# EAGLE schematic MonthCalendar_Controller_v0.9 (EAGLE 9.4.1)
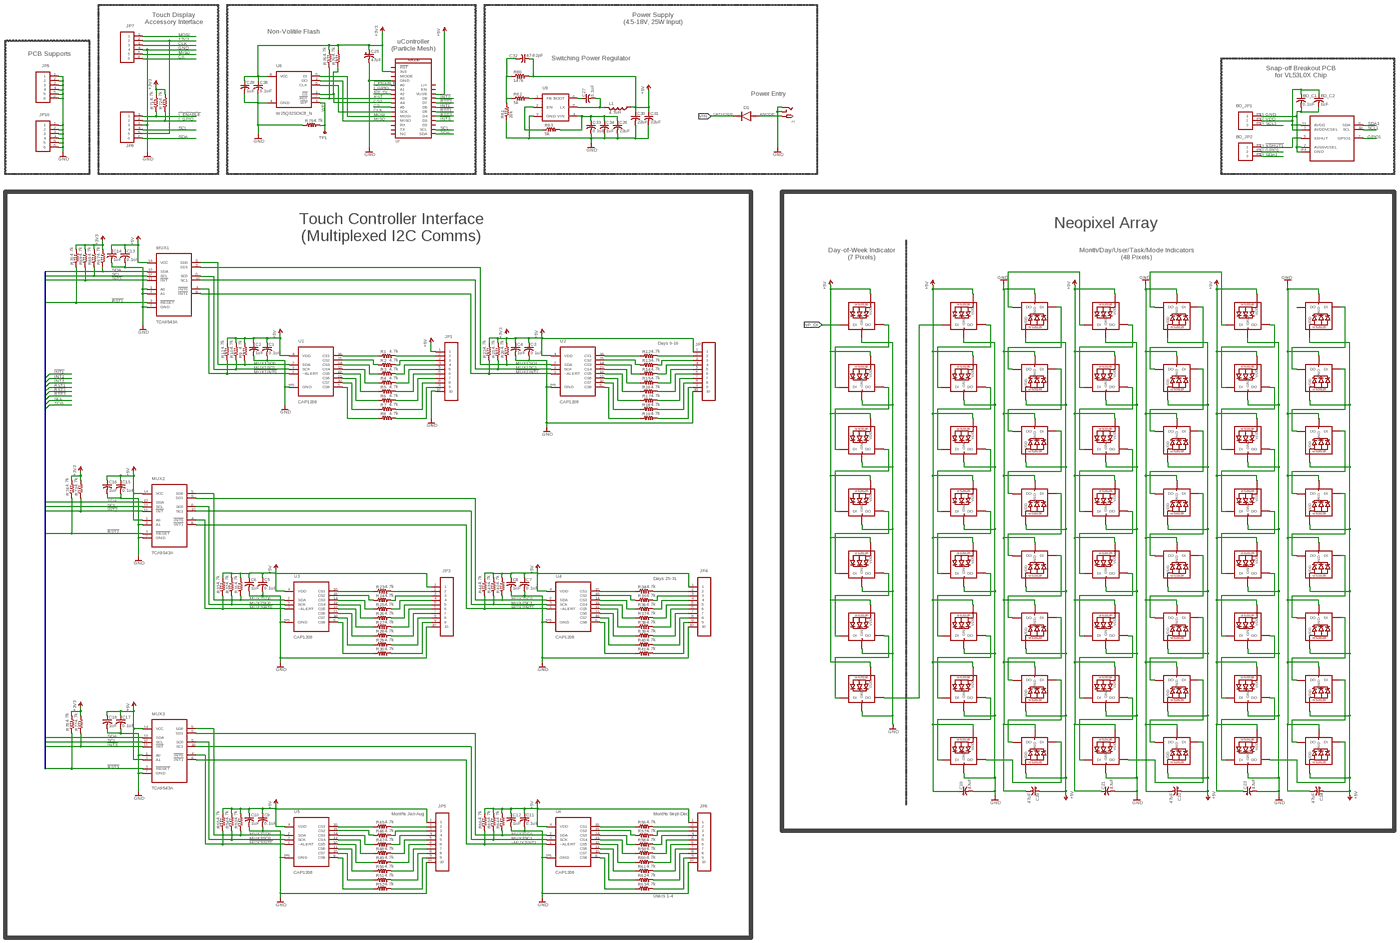
[diagram p0: schematic, sheet 1, overview]
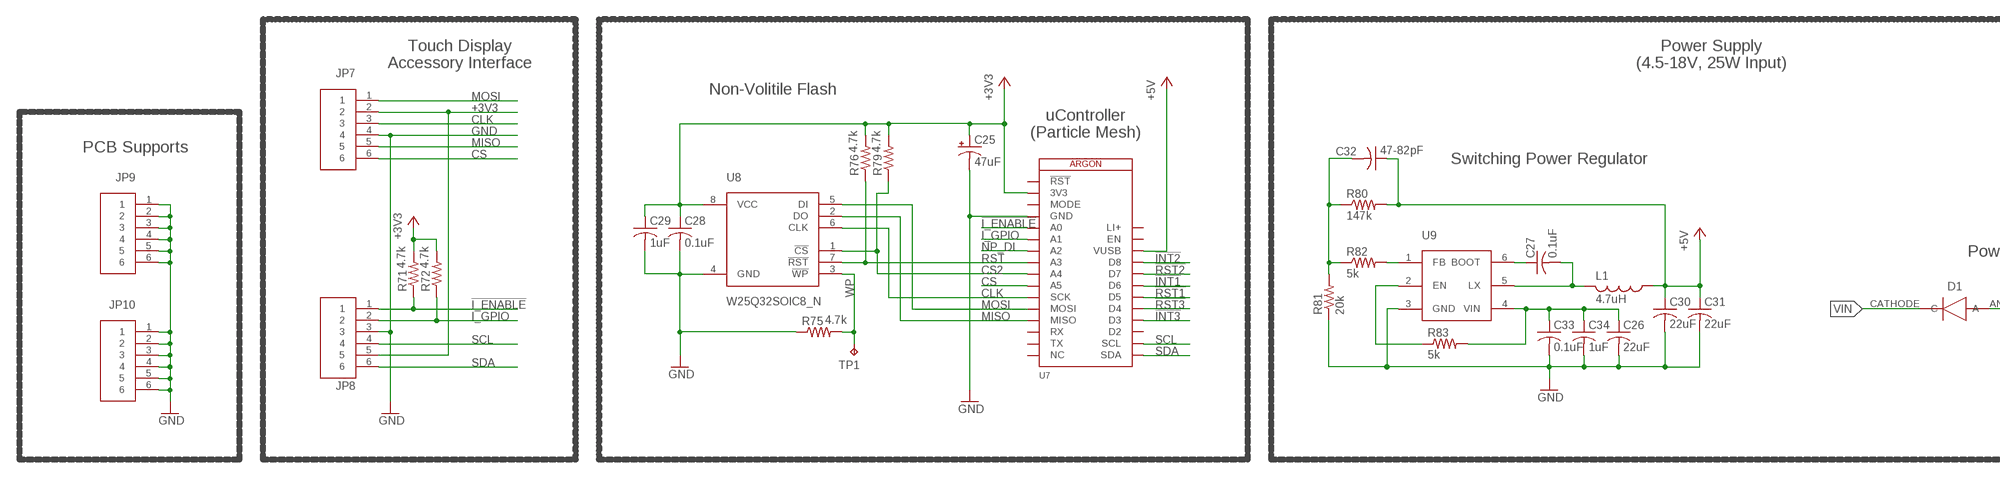
[diagram p1: schematic, sheet 1, part 1 of 4]
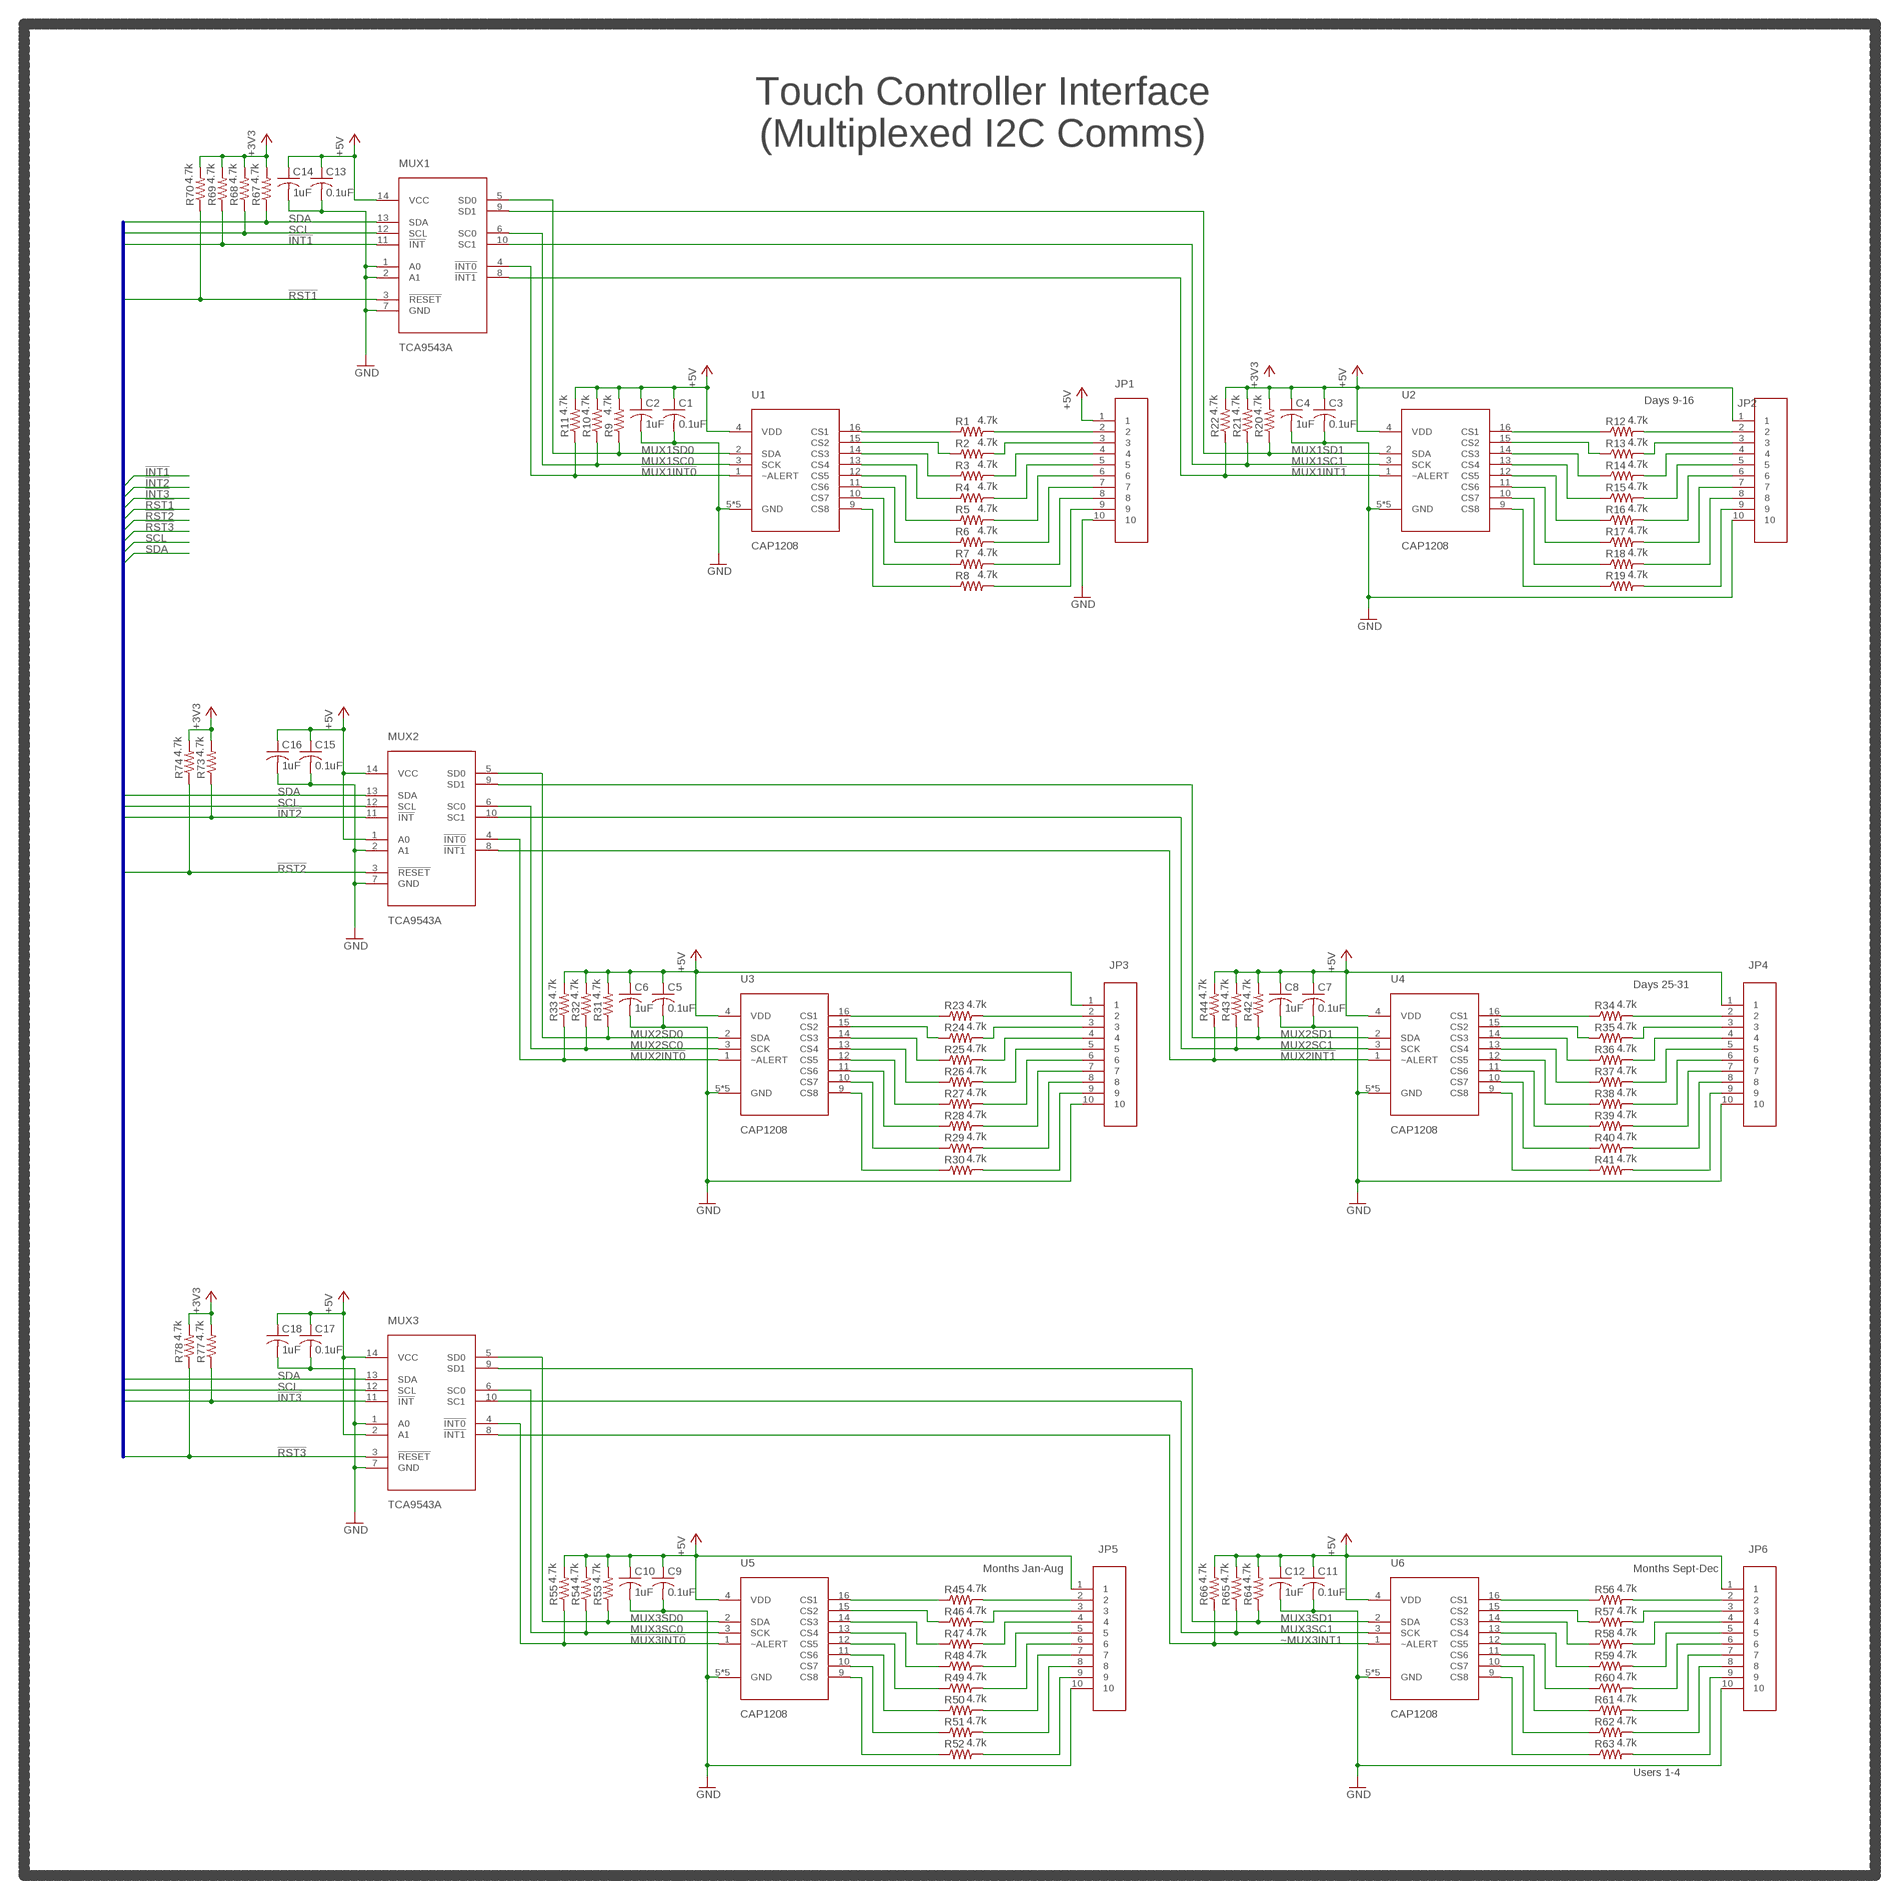
[diagram p2: schematic, sheet 1, part 2 of 4]
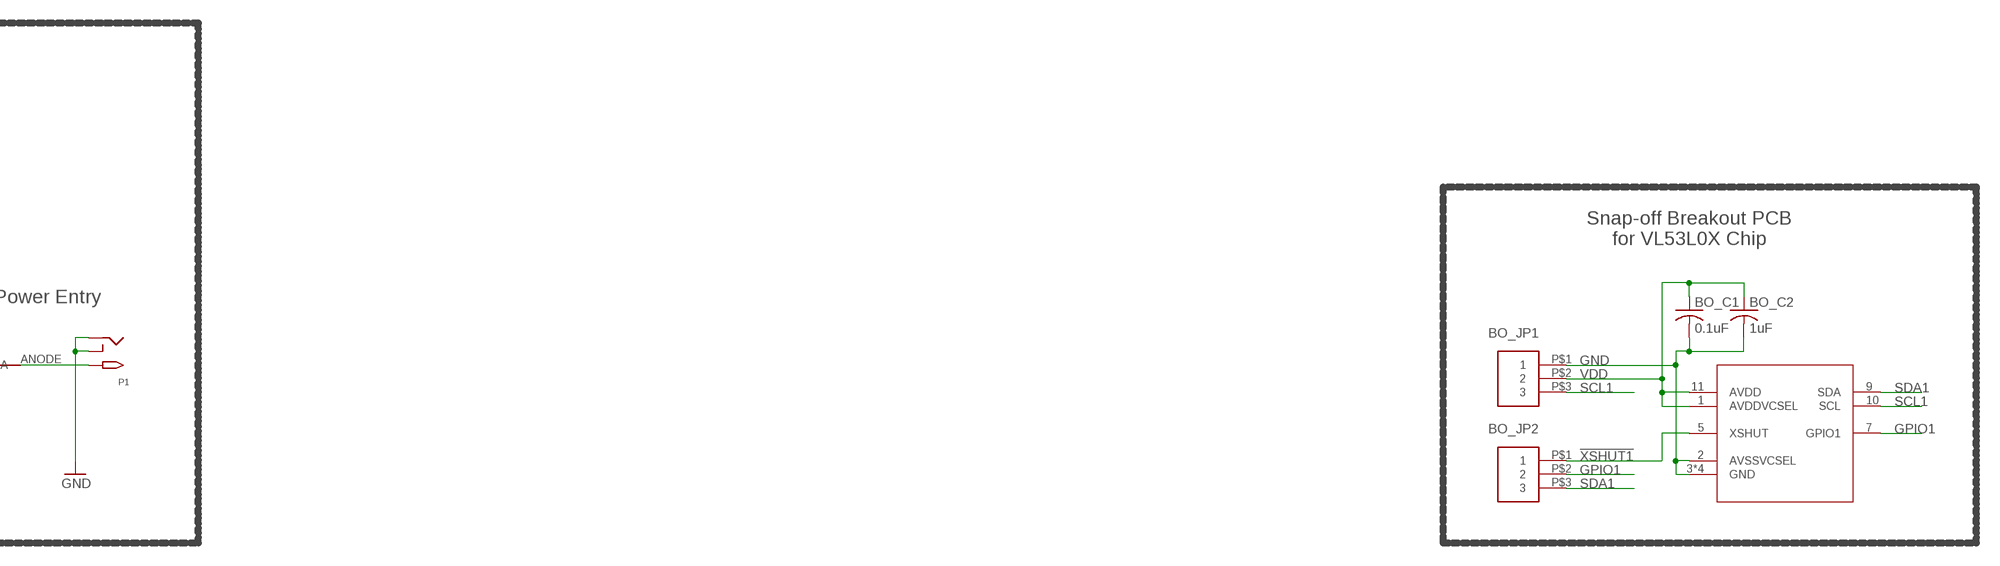
[diagram p3: schematic, sheet 1, part 3 of 4]
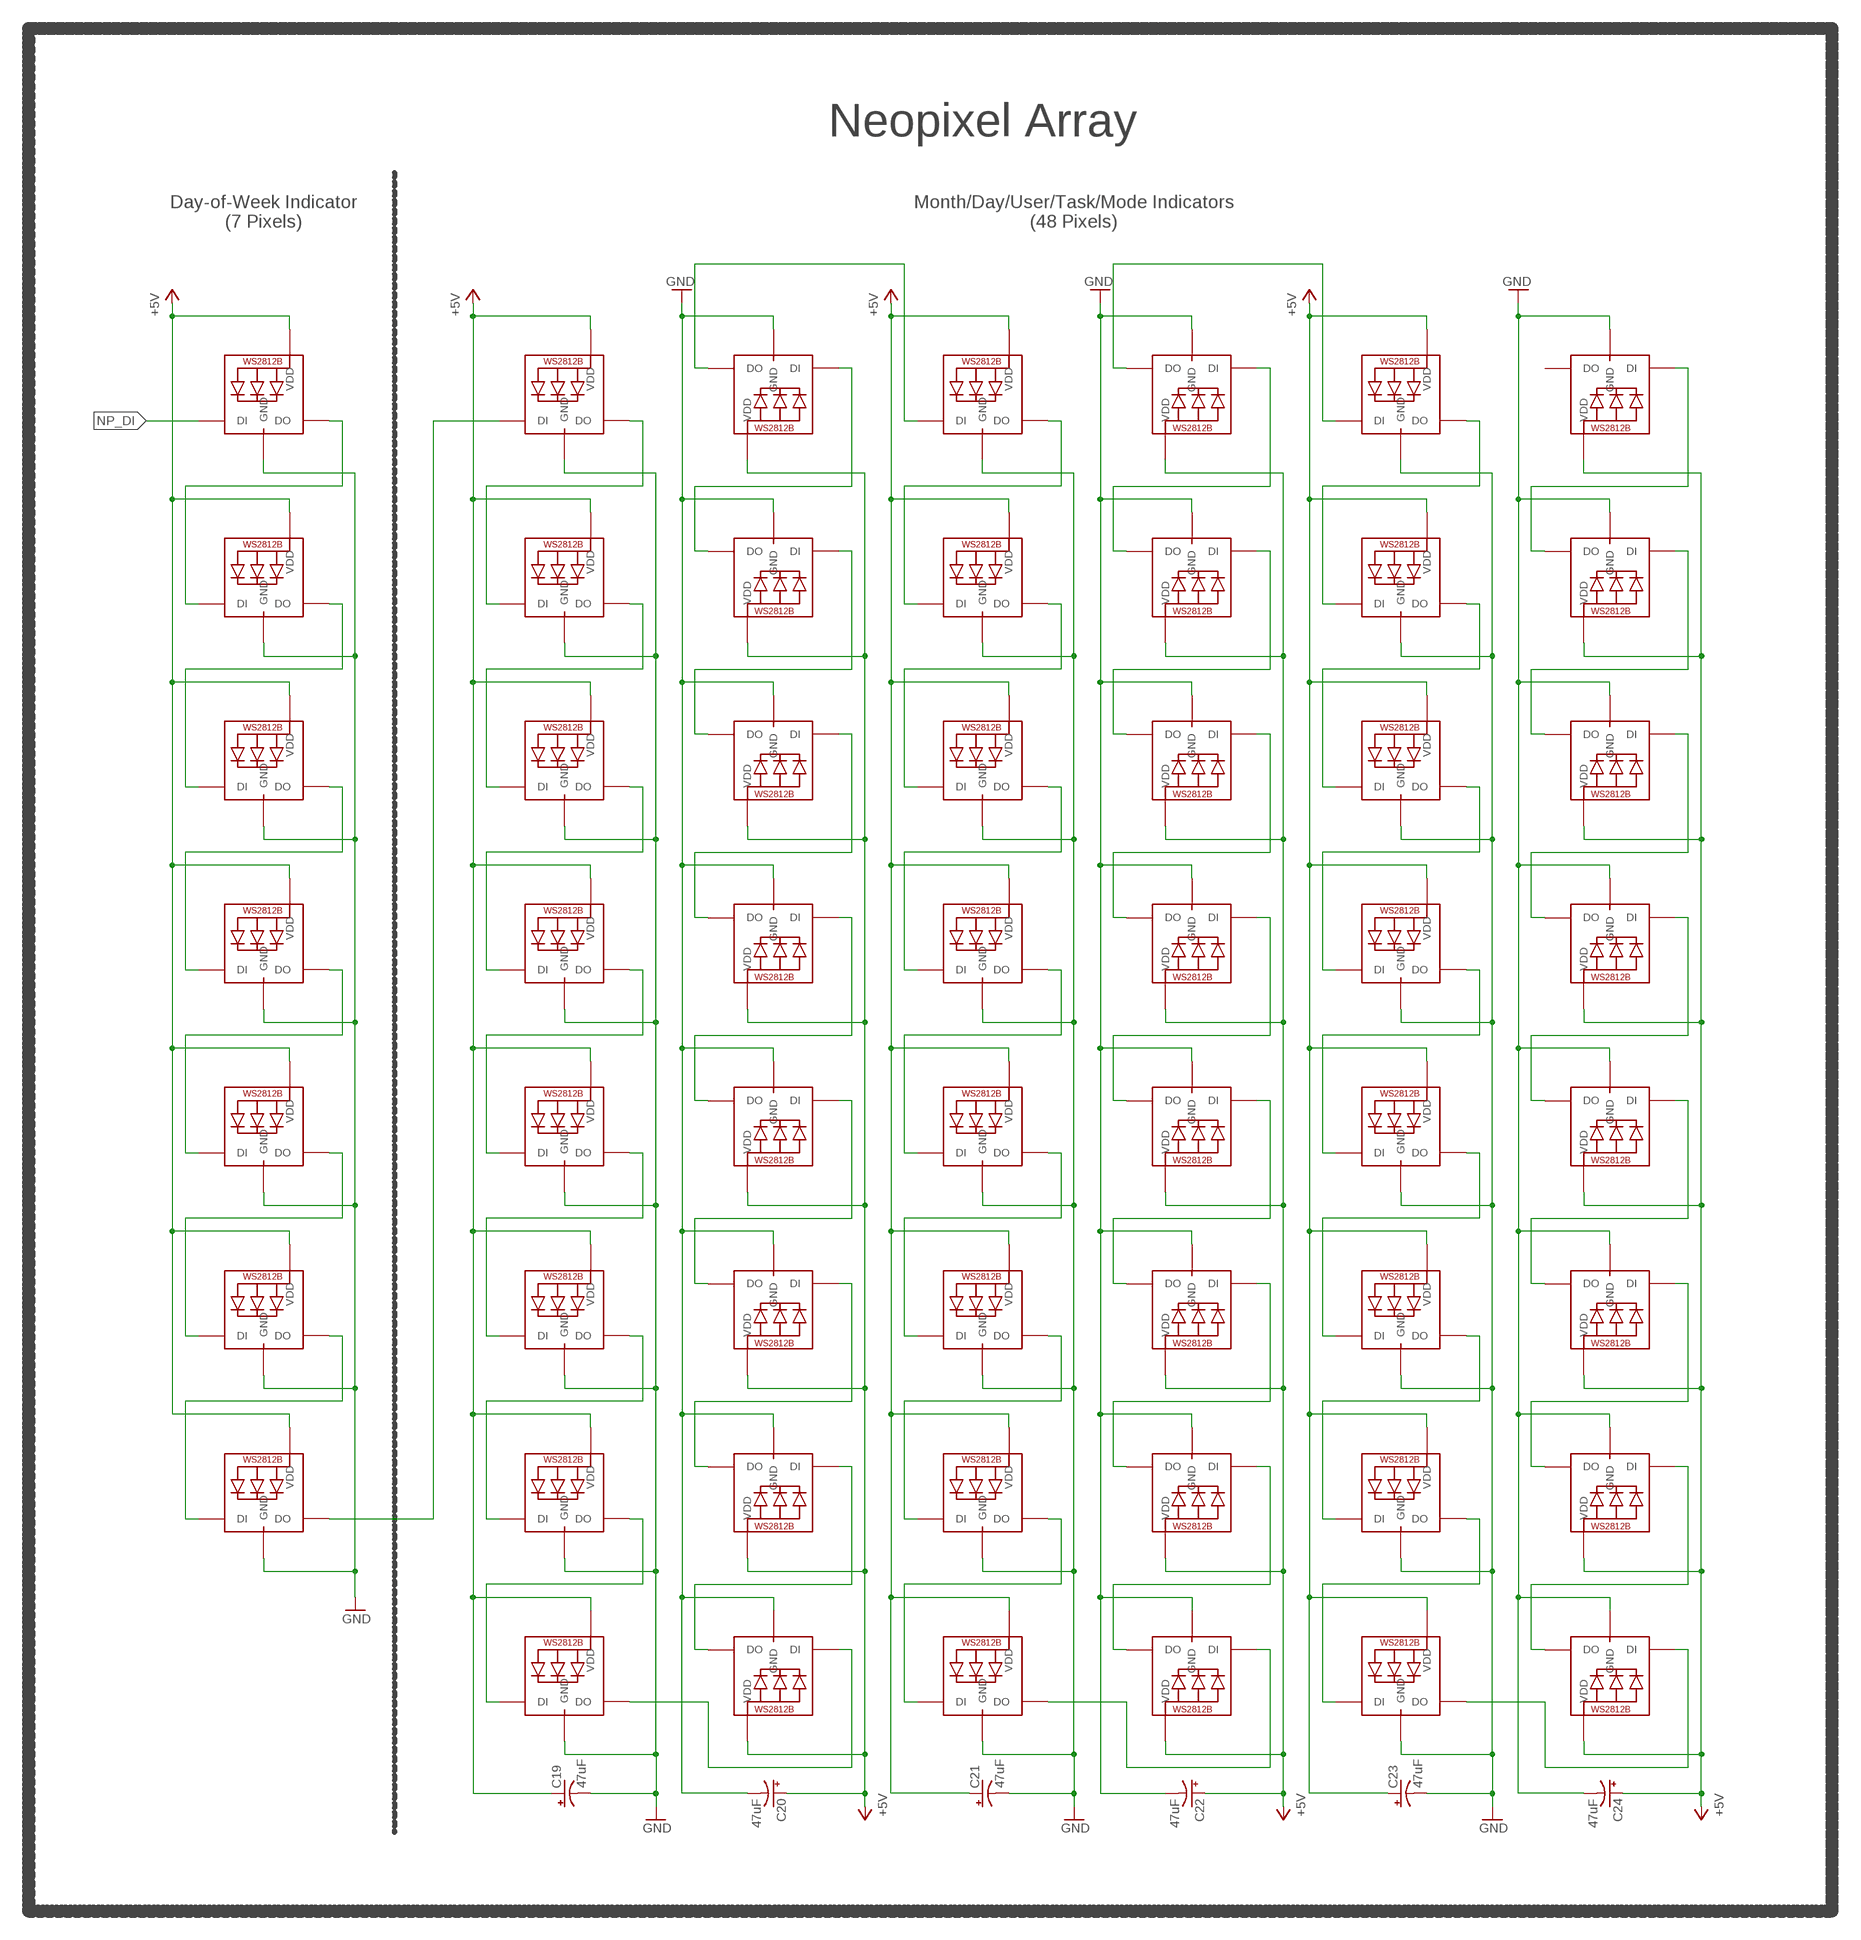
[diagram p4: schematic, sheet 1, part 4 of 4]

## Parts
BO_C1  0.1uF  C-USC0603  [C0603]
BO_C2  1uF  C-USC0603  [C0603]
BO_JP1  PINHEAD_1X350MIL  [PINHEAD_1X3_50MIL]
BO_JP2  PINHEAD_1X350MIL  [PINHEAD_1X3_50MIL]
BO_U1  VL53L0X  [VL53L0X]
C1  0.1uF  C-USC0603  [C0603]
C2  1uF  C-USC0603  [C0603]
C3  0.1uF  C-USC0603  [C0603]
C4  1uF  C-USC0603  [C0603]
C5  0.1uF  C-USC0603  [C0603]
C6  1uF  C-USC0603  [C0603]
C7  0.1uF  C-USC0603  [C0603]
C8  1uF  C-USC0603  [C0603]
C9  0.1uF  C-USC0603  [C0603]
C10  1uF  C-USC0603  [C0603]
C11  0.1uF  C-USC0603  [C0603]
C12  1uF  C-USC0603  [C0603]
C13  0.1uF  C-USC0603  [C0603]
C14  1uF  C-USC0603  [C0603]
C15  0.1uF  C-USC0603  [C0603]
C16  1uF  C-USC0603  [C0603]
C17  0.1uF  C-USC0603  [C0603]
C18  1uF  C-USC0603  [C0603]
C19  47uF  TANT-CAP1206  [EIA3216]
C20  47uF  TANT-CAP1206  [EIA3216]
C21  47uF  TANT-CAP1206  [EIA3216]
C22  47uF  TANT-CAP1206  [EIA3216]
C23  47uF  TANT-CAP1206  [EIA3216]
C24  47uF  TANT-CAP1206  [EIA3216]
C25  47uF  TANT-CAP1206  [EIA3216]
C26  22uF  C-USC1206  [C1206]
C27  0.1uF  C-USC0603  [C0603]
C28  0.1uF  C-USC0603  [C0603]
C29  1uF  C-USC0603  [C0603]
C30  22uF  C-USC1206  [C1206]
C31  22uF  C-USC1206  [C1206]
C32  47-82pF  C-USC0603  [C0603]
C33  0.1uF  C-USC0603  [C0603]
C34  1uF  C-USC0603  [C0603]
D1  DIODE  [SOD-128]
JP1  CON_10POS_1ROWHARWIN_M3531042  [CON_PINHEADER_10P_1R_TH_HARWIN_M50-3531042]
JP2  CON_10POS_1ROWHARWIN_M3531042  [CON_PINHEADER_10P_1R_TH_HARWIN_M50-3531042]
JP3  CON_10POS_1ROWHARWIN_M3531042  [CON_PINHEADER_10P_1R_TH_HARWIN_M50-3531042]
JP4  CON_10POS_1ROWHARWIN_M3531042  [CON_PINHEADER_10P_1R_TH_HARWIN_M50-3531042]
JP5  CON_10POS_1ROWHARWIN_M3531042  [CON_PINHEADER_10P_1R_TH_HARWIN_M50-3531042]
JP6  CON_10POS_1ROWHARWIN_M3531042  [CON_PINHEADER_10P_1R_TH_HARWIN_M50-3531042]
JP7  CON_6POS_1ROW6P1R_M50_35306  [CON_PINHEADER_6P_1R_TH_HARWIN_M50-3530642]
JP8  CON_6POS_1ROW6P1R_M50_35306  [CON_PINHEADER_6P_1R_TH_HARWIN_M50-3530642]
JP9  CON_6POS_1ROW6P1R_M50_35306  [CON_PINHEADER_6P_1R_TH_HARWIN_M50-3530642]
JP10  CON_6POS_1ROW6P1R_M50_35306  [CON_PINHEADER_6P_1R_TH_HARWIN_M50-3530642]
L1  4.7uH  L-US0207/5V  [0207/5V]
LED1  WS2812B5050  [WS2812B]
LED2  WS2812B5050  [WS2812B]
LED3  WS2812B5050  [WS2812B]
LED4  WS2812B5050  [WS2812B]
LED5  WS2812B5050  [WS2812B]
LED6  WS2812B5050  [WS2812B]
LED7  WS2812B5050  [WS2812B]
LED8  WS2812B5050  [WS2812B]
LED9  WS2812B5050  [WS2812B]
LED10  WS2812B5050  [WS2812B]
LED11  WS2812B5050  [WS2812B]
LED12  WS2812B5050  [WS2812B]
LED13  WS2812B5050  [WS2812B]
LED14  WS2812B5050  [WS2812B]
LED15  WS2812B5050  [WS2812B]
LED16  WS2812B5050  [WS2812B]
LED17  WS2812B5050  [WS2812B]
LED18  WS2812B5050  [WS2812B]
LED19  WS2812B5050  [WS2812B]
LED20  WS2812B5050  [WS2812B]
LED21  WS2812B5050  [WS2812B]
LED22  WS2812B5050  [WS2812B]
LED23  WS2812B5050  [WS2812B]
LED24  WS2812B5050  [WS2812B]
LED25  WS2812B5050  [WS2812B]
LED26  WS2812B5050  [WS2812B]
LED27  WS2812B5050  [WS2812B]
LED28  WS2812B5050  [WS2812B]
LED29  WS2812B5050  [WS2812B]
LED30  WS2812B5050  [WS2812B]
LED31  WS2812B5050  [WS2812B]
LED32  WS2812B5050  [WS2812B]
LED33  WS2812B5050  [WS2812B]
LED34  WS2812B5050  [WS2812B]
LED35  WS2812B5050  [WS2812B]
LED36  WS2812B5050  [WS2812B]
LED37  WS2812B5050  [WS2812B]
LED38  WS2812B5050  [WS2812B]
LED39  WS2812B5050  [WS2812B]
LED40  WS2812B5050  [WS2812B]
LED41  WS2812B5050  [WS2812B]
LED42  WS2812B5050  [WS2812B]
LED43  WS2812B5050  [WS2812B]
LED44  WS2812B5050  [WS2812B]
LED45  WS2812B5050  [WS2812B]
LED46  WS2812B5050  [WS2812B]
LED47  WS2812B5050  [WS2812B]
LED48  WS2812B5050  [WS2812B]
LED49  WS2812B5050  [WS2812B]
LED50  WS2812B5050  [WS2812B]
LED51  WS2812B5050  [WS2812B]
LED52  WS2812B5050  [WS2812B]
LED53  WS2812B5050  [WS2812B]
LED54  WS2812B5050  [WS2812B]
LED55  WS2812B5050  [WS2812B]
MUX1  TCA9543A  [TSSOP-14]
MUX2  TCA9543A  [TSSOP-14]
MUX3  TCA9543A  [TSSOP-14]
P1  2.1MMJACKTHM  [PJ-102A]
R1  4.7k  R-US_R0603  [R0603]
R2  4.7k  R-US_R0603  [R0603]
R3  4.7k  R-US_R0603  [R0603]
R4  4.7k  R-US_R0603  [R0603]
R5  4.7k  R-US_R0603  [R0603]
R6  4.7k  R-US_R0603  [R0603]
R7  4.7k  R-US_R0603  [R0603]
R8  4.7k  R-US_R0603  [R0603]
R9  4.7k  R-US_R0603  [R0603]
R10  4.7k  R-US_R0603  [R0603]
R11  4.7k  R-US_R0603  [R0603]
R12  4.7k  R-US_R0603  [R0603]
R13  4.7k  R-US_R0603  [R0603]
R14  4.7k  R-US_R0603  [R0603]
R15  4.7k  R-US_R0603  [R0603]
R16  4.7k  R-US_R0603  [R0603]
R17  4.7k  R-US_R0603  [R0603]
R18  4.7k  R-US_R0603  [R0603]
R19  4.7k  R-US_R0603  [R0603]
R20  4.7k  R-US_R0603  [R0603]
R21  4.7k  R-US_R0603  [R0603]
R22  4.7k  R-US_R0603  [R0603]
R23  4.7k  R-US_R0603  [R0603]
R24  4.7k  R-US_R0603  [R0603]
R25  4.7k  R-US_R0603  [R0603]
R26  4.7k  R-US_R0603  [R0603]
R27  4.7k  R-US_R0603  [R0603]
R28  4.7k  R-US_R0603  [R0603]
R29  4.7k  R-US_R0603  [R0603]
R30  4.7k  R-US_R0603  [R0603]
R31  4.7k  R-US_R0603  [R0603]
R32  4.7k  R-US_R0603  [R0603]
R33  4.7k  R-US_R0603  [R0603]
R34  4.7k  R-US_R0603  [R0603]
R35  4.7k  R-US_R0603  [R0603]
R36  4.7k  R-US_R0603  [R0603]
R37  4.7k  R-US_R0603  [R0603]
R38  4.7k  R-US_R0603  [R0603]
R39  4.7k  R-US_R0603  [R0603]
R40  4.7k  R-US_R0603  [R0603]
R41  4.7k  R-US_R0603  [R0603]
R42  4.7k  R-US_R0603  [R0603]
R43  4.7k  R-US_R0603  [R0603]
R44  4.7k  R-US_R0603  [R0603]
R45  4.7k  R-US_R0603  [R0603]
R46  4.7k  R-US_R0603  [R0603]
R47  4.7k  R-US_R0603  [R0603]
R48  4.7k  R-US_R0603  [R0603]
R49  4.7k  R-US_R0603  [R0603]
R50  4.7k  R-US_R0603  [R0603]
R51  4.7k  R-US_R0603  [R0603]
R52  4.7k  R-US_R0603  [R0603]
R53  4.7k  R-US_R0603  [R0603]
R54  4.7k  R-US_R0603  [R0603]
R55  4.7k  R-US_R0603  [R0603]
R56  4.7k  R-US_R0603  [R0603]
R57  4.7k  R-US_R0603  [R0603]
R58  4.7k  R-US_R0603  [R0603]
R59  4.7k  R-US_R0603  [R0603]
R60  4.7k  R-US_R0603  [R0603]
R61  4.7k  R-US_R0603  [R0603]
R62  4.7k  R-US_R0603  [R0603]
R63  4.7k  R-US_R0603  [R0603]
R64  4.7k  R-US_R0603  [R0603]
R65  4.7k  R-US_R0603  [R0603]
R66  4.7k  R-US_R0603  [R0603]
R67  4.7k  R-US_R0603  [R0603]
R68  4.7k  R-US_R0603  [R0603]
R69  4.7k  R-US_R0603  [R0603]
R70  4.7k  R-US_R0603  [R0603]
R71  4.7k  R-US_R0603  [R0603]
R72  4.7k  R-US_R0603  [R0603]
R73  4.7k  R-US_R0603  [R0603]
R74  4.7k  R-US_R0603  [R0603]
R75  4.7k  R-US_R0603  [R0603]
R76  4.7k  R-US_R0603  [R0603]
R77  4.7k  R-US_R0603  [R0603]
R78  4.7k  R-US_R0603  [R0603]
R79  4.7k  R-US_R0603  [R0603]
R80  147k  R-US_R0603  [R0603]
R81  20k  R-US_R0603  [R0603]
R82  5k  R-US_R0603  [R0603]
R83  5k  R-US_R0603  [R0603]
TP1  TPTP20SQ  [TP20SQ]
U1  CAP1208  [QFN-16-3X3]
U2  CAP1208  [QFN-16-3X3]
U3  CAP1208  [QFN-16-3X3]
U4  CAP1208  [QFN-16-3X3]
U5  CAP1208  [QFN-16-3X3]
U6  CAP1208  [QFN-16-3X3]
U7  ARGON  [ARGON]
U8  W25Q32SOIC8_N  [SOIC-8_NARROW]
U9  RT6255AHGJ6FCT-ND  RT6255A/B_J6F  [SOT-23-6]

## Nets
!I_ENABLE: JP8.1 R71.1 U7.5(A0)
!INT1: MUX1.11(!INT) R69.1 U7.23(D6)
!INT2: MUX2.11(!INT) R73.1 U7.25(D8)
!INT3: MUX3.11(!INT) R77.1 U7.20(D3)
!MUX1INT0: MUX1.4(!INT0) R11.1 U1.1(~ALERT)
!MUX1INT1: MUX1.8(!INT1) R22.1 U2.1(~ALERT)
!MUX2INT0: MUX2.4(!INT0) R33.1 U3.1(~ALERT)
!MUX2INT1: MUX2.8(!INT1) R44.1 U4.1(~ALERT)
!MUX3INT0: MUX3.4(!INT0) R55.1 U5.1(~ALERT)
!RST1: MUX1.3(!RESET) R70.1 U7.22(D5)
!RST2: MUX2.3(!RESET) R74.1 U7.24(D7)
!RST3: MUX3.3(!RESET) R78.1 U7.21(D4)
!XSHUT1: BO_JP2.P$1 BO_U1.5(XSHUT)
+3V3: C25.A(+) C28.1 C29.1 JP7.2 JP8.5 R67.2 R68.2 R69.2 R70.2 R71.2 R72.2 R73.2 R74.2 R76.2 R77.2 R78.2 R79.2 U7.2(3V3) U8.8(VCC)
+5V: C1.1 C2.1 C3.1 C4.1 C5.1 C6.1 C7.1 C8.1 C9.1 C10.1 C11.1 C12.1 C13.1 C14.1 C15.1 C16.1 C17.1 C18.1 C19.A(+) C20.A(+) C21.A(+) C22.A(+) C23.A(+) C24.A(+) C30.1 C31.1 C32.1 JP1.1 JP2.1 JP3.1 JP4.1 JP5.1 JP6.1 L1.1 LED1.1-VDD(VDD) LED2.1-VDD(VDD) LED3.1-VDD(VDD) LED4.1-VDD(VDD) LED5.1-VDD(VDD) LED6.1-VDD(VDD) LED7.1-VDD(VDD) LED8.1-VDD(VDD) LED9.1-VDD(VDD) LED10.1-VDD(VDD) LED11.1-VDD(VDD) LED12.1-VDD(VDD) LED13.1-VDD(VDD) LED14.1-VDD(VDD) LED15.1-VDD(VDD) LED16.1-VDD(VDD) LED17.1-VDD(VDD) LED18.1-VDD(VDD) LED19.1-VDD(VDD) LED20.1-VDD(VDD) LED21.1-VDD(VDD) LED22.1-VDD(VDD) LED23.1-VDD(VDD) LED24.1-VDD(VDD) LED25.1-VDD(VDD) LED26.1-VDD(VDD) LED27.1-VDD(VDD) LED28.1-VDD(VDD) LED29.1-VDD(VDD) LED30.1-VDD(VDD) LED31.1-VDD(VDD) LED32.1-VDD(VDD) LED33.1-VDD(VDD) LED34.1-VDD(VDD) LED35.1-VDD(VDD) LED36.1-VDD(VDD) LED37.1-VDD(VDD) LED38.1-VDD(VDD) LED39.1-VDD(VDD) LED40.1-VDD(VDD) LED41.1-VDD(VDD) LED42.1-VDD(VDD) LED43.1-VDD(VDD) LED44.1-VDD(VDD) LED45.1-VDD(VDD) LED46.1-VDD(VDD) LED47.1-VDD(VDD) LED48.1-VDD(VDD) LED49.1-VDD(VDD) LED50.1-VDD(VDD) LED51.1-VDD(VDD) LED52.1-VDD(VDD) LED53.1-VDD(VDD) LED54.1-VDD(VDD) LED55.1-VDD(VDD) MUX1.14(VCC) MUX2.1(A0) MUX2.14(VCC) MUX3.2(A1) MUX3.14(VCC) R9.2 R10.2 R11.2 R20.2 R21.2 R22.2 R31.2 R32.2 R33.2 R42.2 R43.2 R44.2 R53.2 R54.2 R55.2 R64.2 R65.2 R66.2 R80.2 U1.4(VDD) U2.4(VDD) U3.4(VDD) U4.4(VDD) U5.4(VDD) U6.4(VDD) U7.26(VUSB)
BOOT: C27.1 U9.6(BOOT)
CLK: JP7.3 U7.11(SCK) U8.6(CLK)
CS: JP7.6 U7.10(A5)
CS2: R79.1 U7.9(A4) U8.1(!CS)
EN: R83.1 U9.2(EN)
FB: R82.2 U9.1(FB)
GND: BO_C1.2 BO_C2.2 BO_JP1.P$1 BO_U1.2(AVSSVCSEL) BO_U1.3(GND) BO_U1.4(GND) BO_U1.6(GND) BO_U1.12(GND) C1.2 C2.2 C3.2 C4.2 C5.2 C6.2 C7.2 C8.2 C9.2 C10.2 C11.2 C12.2 C13.2 C14.2 C15.2 C16.2 C17.2 C18.2 C19.C(-) C20.C(-) C21.C(-) C22.C(-) C23.C(-) C24.C(-) C25.C(-) C26.2 C28.2 C29.2 C30.2 C31.2 C33.2 C34.2 JP1.10 JP2.10 JP3.10 JP4.10 JP5.10 JP6.10 JP7.4 JP8.3 JP9.1 JP9.2 JP9.3 JP9.4 JP9.5 JP9.6 JP10.1 JP10.2 JP10.3 JP10.4 JP10.5 JP10.6 LED1.3-GND(GND) LED2.3-GND(GND) LED3.3-GND(GND) LED4.3-GND(GND) LED5.3-GND(GND) LED6.3-GND(GND) LED7.3-GND(GND) LED8.3-GND(GND) LED9.3-GND(GND) LED10.3-GND(GND) LED11.3-GND(GND) LED12.3-GND(GND) LED13.3-GND(GND) LED14.3-GND(GND) LED15.3-GND(GND) LED16.3-GND(GND) LED17.3-GND(GND) LED18.3-GND(GND) LED19.3-GND(GND) LED20.3-GND(GND) LED21.3-GND(GND) LED22.3-GND(GND) LED23.3-GND(GND) LED24.3-GND(GND) LED25.3-GND(GND) LED26.3-GND(GND) LED27.3-GND(GND) LED28.3-GND(GND) LED29.3-GND(GND) LED30.3-GND(GND) LED31.3-GND(GND) LED32.3-GND(GND) LED33.3-GND(GND) LED34.3-GND(GND) LED35.3-GND(GND) LED36.3-GND(GND) LED37.3-GND(GND) LED38.3-GND(GND) LED39.3-GND(GND) LED40.3-GND(GND) LED41.3-GND(GND) LED42.3-GND(GND) LED43.3-GND(GND) LED44.3-GND(GND) LED45.3-GND(GND) LED46.3-GND(GND) LED47.3-GND(GND) LED48.3-GND(GND) LED49.3-GND(GND) LED50.3-GND(GND) LED51.3-GND(GND) LED52.3-GND(GND) LED53.3-GND(GND) LED54.3-GND(GND) LED55.3-GND(GND) MUX1.1(A0) MUX1.2(A1) MUX1.7(GND) MUX2.2(A1) MUX2.7(GND) MUX3.1(A0) MUX3.7(GND) P1.RING P1.RING_SW R75.1 R81.1 U1.5(GND) U1.6(GND) U1.7(GND) U1.8(GND) U1.PAD(GND) U2.5(GND) U2.6(GND) U2.7(GND) U2.8(GND) U2.PAD(GND) U3.5(GND) U3.6(GND) U3.7(GND) U3.8(GND) U3.PAD(GND) U4.5(GND) U4.6(GND) U4.7(GND) U4.8(GND) U4.PAD(GND) U5.5(GND) U5.6(GND) U5.7(GND) U5.8(GND) U5.PAD(GND) U6.5(GND) U6.6(GND) U6.7(GND) U6.8(GND) U6.PAD(GND) U7.4(GND) U8.4(GND) U9.3(GND)
GPIO1: BO_JP2.P$2 BO_U1.7(GPIO1)
I_GPIO: JP8.2 R72.1 U7.6(A1)
LX: C27.2 L1.2 U9.5(LX)
MISO: JP7.5 U7.13(MISO) U8.2(DO)
MOSI: JP7.1 U7.12(MOSI) U8.5(DI)
MUX1SC0: MUX1.6(SC0) R10.1 U1.3(SCK)
MUX1SC1: MUX1.10(SC1) R21.1 U2.3(SCK)
MUX1SD0: MUX1.5(SD0) R9.1 U1.2(SDA)
MUX1SD1: MUX1.9(SD1) R20.1 U2.2(SDA)
MUX2SC0: MUX2.6(SC0) R32.1 U3.3(SCK)
MUX2SC1: MUX2.10(SC1) R43.1 U4.3(SCK)
MUX2SD0: MUX2.5(SD0) R31.1 U3.2(SDA)
MUX2SD1: MUX2.9(SD1) R42.1 U4.2(SDA)
MUX3SC0: MUX3.6(SC0) R54.1 U5.3(SCK)
MUX3SC1: MUX3.10(SC1) R65.1 U6.3(SCK)
MUX3SD0: MUX3.5(SD0) R53.1 U5.2(SDA)
MUX3SD1: MUX3.9(SD1) R64.1 U6.2(SDA)
N$1: R1.1 U1.16(CS1)
N$2: JP1.2 R1.2
N$3: JP1.3 R2.2
N$4: R2.1 U1.15(CS2)
N$5: R3.1 U1.14(CS3)
N$6: R4.1 U1.13(CS4)
N$7: R5.1 U1.12(CS5)
N$8: R6.1 U1.11(CS6)
N$9: R7.1 U1.10(CS7)
N$10: R8.1 U1.9(CS8)
N$11: JP1.4 R3.2
N$12: R12.1 U2.16(CS1)
N$13: R13.1 U2.15(CS2)
N$14: R14.1 U2.14(CS3)
N$15: R15.1 U2.13(CS4)
N$16: R16.1 U2.12(CS5)
N$17: R17.1 U2.11(CS6)
N$18: R18.1 U2.10(CS7)
N$19: R19.1 U2.9(CS8)
N$20: JP2.2 R12.2
N$21: JP1.5 R4.2
N$22: JP1.6 R5.2
N$23: JP1.7 R6.2
N$24: JP1.8 R7.2
N$25: JP1.9 R8.2
N$26: LED1.2-DOUT(DO) LED2.4-DIN(DI)
N$27: LED2.2-DOUT(DO) LED3.4-DIN(DI)
N$28: LED3.2-DOUT(DO) LED4.4-DIN(DI)
N$29: JP2.3 R13.2
N$30: JP2.4 R14.2
N$31: JP2.5 R15.2
N$32: JP2.6 R16.2
N$33: JP2.7 R17.2
N$34: JP2.8 R18.2
N$35: JP2.9 R19.2
N$36: LED4.2-DOUT(DO) LED5.4-DIN(DI)
N$37: LED5.2-DOUT(DO) LED6.4-DIN(DI)
N$38: LED6.2-DOUT(DO) LED7.4-DIN(DI)
N$39: R23.1 U3.16(CS1)
N$40: R24.1 U3.15(CS2)
N$41: R25.1 U3.14(CS3)
N$42: R26.1 U3.13(CS4)
N$43: R27.1 U3.12(CS5)
N$44: R28.1 U3.11(CS6)
N$45: R29.1 U3.10(CS7)
N$46: R30.1 U3.9(CS8)
N$47: JP3.2 R23.2
N$48: JP3.3 R24.2
N$49: JP3.4 R25.2
N$50: JP3.5 R26.2
N$51: JP3.6 R27.2
N$52: JP3.7 R28.2
N$53: JP3.8 R29.2
N$54: JP3.9 R30.2
N$55: LED7.2-DOUT(DO) LED8.4-DIN(DI)
N$56: LED9.2-DOUT(DO) LED10.4-DIN(DI)
N$57: LED10.2-DOUT(DO) LED11.4-DIN(DI)
N$58: R34.1 U4.16(CS1)
N$59: R35.1 U4.15(CS2)
N$60: R36.1 U4.14(CS3)
N$61: R37.1 U4.13(CS4)
N$62: R38.1 U4.12(CS5)
N$63: R39.1 U4.11(CS6)
N$64: R40.1 U4.10(CS7)
N$65: R41.1 U4.9(CS8)
N$66: JP4.2 R34.2
N$67: JP4.3 R35.2
N$68: JP4.4 R36.2
N$69: JP4.5 R37.2
N$70: JP4.6 R38.2
N$71: JP4.7 R39.2
N$72: JP4.8 R40.2
N$73: JP4.9 R41.2
N$74: LED11.2-DOUT(DO) LED12.4-DIN(DI)
N$75: LED12.2-DOUT(DO) LED13.4-DIN(DI)
N$76: LED13.2-DOUT(DO) LED14.4-DIN(DI)
N$77: R45.1 U5.16(CS1)
N$78: R46.1 U5.15(CS2)
N$79: R47.1 U5.14(CS3)
N$80: R48.1 U5.13(CS4)
N$81: R49.1 U5.12(CS5)
N$82: R50.1 U5.11(CS6)
N$83: R51.1 U5.10(CS7)
N$84: R52.1 U5.9(CS8)
N$85: JP5.2 R45.2
N$86: JP5.3 R46.2
N$87: JP5.4 R47.2
N$88: JP5.5 R48.2
N$89: JP5.6 R49.2
N$90: JP5.7 R50.2
N$91: JP5.8 R51.2
N$92: JP5.9 R52.2
N$93: LED14.2-DOUT(DO) LED15.4-DIN(DI)
N$94: LED15.2-DOUT(DO) LED16.4-DIN(DI)
N$95: LED17.2-DOUT(DO) LED18.4-DIN(DI)
N$96: R56.1 U6.16(CS1)
N$97: R57.1 U6.15(CS2)
N$98: R58.1 U6.14(CS3)
N$99: R59.1 U6.13(CS4)
N$100: R60.1 U6.12(CS5)
N$101: R61.1 U6.11(CS6)
N$102: R62.1 U6.10(CS7)
N$103: R63.1 U6.9(CS8)
N$104: JP6.2 R56.2
N$105: JP6.3 R57.2
N$106: JP6.4 R58.2
N$107: JP6.5 R59.2
N$108: JP6.6 R60.2
N$109: JP6.7 R61.2
N$110: JP6.8 R62.2
N$111: JP6.9 R63.2
N$112: LED18.2-DOUT(DO) LED19.4-DIN(DI)
N$113: LED19.2-DOUT(DO) LED20.4-DIN(DI)
N$114: LED20.2-DOUT(DO) LED21.4-DIN(DI)
N$115: LED21.2-DOUT(DO) LED22.4-DIN(DI)
N$116: LED22.2-DOUT(DO) LED23.4-DIN(DI)
N$117: LED23.2-DOUT(DO) LED24.4-DIN(DI)
N$118: LED25.2-DOUT(DO) LED26.4-DIN(DI)
N$119: LED26.2-DOUT(DO) LED27.4-DIN(DI)
N$120: LED27.2-DOUT(DO) LED28.4-DIN(DI)
N$121: LED28.2-DOUT(DO) LED29.4-DIN(DI)
N$122: LED29.2-DOUT(DO) LED30.4-DIN(DI)
N$123: LED30.2-DOUT(DO) LED31.4-DIN(DI)
N$124: LED31.2-DOUT(DO) LED32.4-DIN(DI)
N$125: LED33.2-DOUT(DO) LED34.4-DIN(DI)
N$126: LED34.2-DOUT(DO) LED35.4-DIN(DI)
N$127: LED35.2-DOUT(DO) LED36.4-DIN(DI)
N$128: LED36.2-DOUT(DO) LED37.4-DIN(DI)
N$129: LED37.2-DOUT(DO) LED38.4-DIN(DI)
N$130: LED38.2-DOUT(DO) LED39.4-DIN(DI)
N$131: LED39.2-DOUT(DO) LED40.4-DIN(DI)
N$132: LED41.2-DOUT(DO) LED42.4-DIN(DI)
N$133: LED42.2-DOUT(DO) LED43.4-DIN(DI)
N$134: LED43.2-DOUT(DO) LED44.4-DIN(DI)
N$135: LED44.2-DOUT(DO) LED45.4-DIN(DI)
N$136: LED45.2-DOUT(DO) LED46.4-DIN(DI)
N$137: LED46.2-DOUT(DO) LED47.4-DIN(DI)
N$138: LED47.2-DOUT(DO) LED48.4-DIN(DI)
N$139: LED8.2-DOUT(DO) LED9.4-DIN(DI)
N$140: LED24.2-DOUT(DO) LED25.4-DIN(DI)
N$141: LED40.2-DOUT(DO) LED41.4-DIN(DI)
N$142: LED16.2-DOUT(DO) LED17.4-DIN(DI)
N$143: LED32.2-DOUT(DO) LED33.4-DIN(DI)
N$144: LED49.2-DOUT(DO) LED50.4-DIN(DI)
N$145: LED50.2-DOUT(DO) LED51.4-DIN(DI)
N$146: LED51.2-DOUT(DO) LED52.4-DIN(DI)
N$147: LED52.2-DOUT(DO) LED53.4-DIN(DI)
N$148: LED53.2-DOUT(DO) LED54.4-DIN(DI)
N$149: LED54.2-DOUT(DO) LED55.4-DIN(DI)
N$150: LED1.4-DIN(DI) LED55.2-DOUT(DO)
N$152: C32.2 R80.1 R81.2 R82.1
NP_DI: LED49.4-DIN(DI) U7.7(A2)
RST: R76.1 U7.8(A3) U8.7(!RST)
SCL: JP8.4 MUX1.12(SCL) MUX2.12(SCL) MUX3.12(SCL) R68.1 U7.18(SCL)
SCL1: BO_JP1.P$3 BO_U1.10(SCL)
SDA: JP8.6 MUX1.13(SDA) MUX2.13(SDA) MUX3.13(SDA) R67.1 U7.17(SDA)
SDA1: BO_JP2.P$3 BO_U1.9(SDA)
VDD: BO_C1.1 BO_C2.1 BO_JP1.P$2 BO_U1.1(AVDDVCSEL) BO_U1.11(AVDD)
VIN: C26.1 C33.1 C34.1 D1.CATHODE(C) R83.2 U9.4(VIN)
VPORT: D1.ANODE(A) P1.TIP
WP: R75.2 TP1.TP U8.3(!WP)
~MUX3INT1: MUX3.8(!INT1) R66.1 U6.1(~ALERT)
Unconnected: LED48.2-DOUT(DO) U7.1(!RST) U7.3(MODE) U7.14(RX) U7.15(TX) U7.16(NC) U7.19(D2) U7.27(EN)

## Buses
!INT1,!INT2,!INT3,!RST1,!RST2,!RST3,SCL,SDA

## Notes on the sheet
- Touch Display
  Accessory Interface
- Power Supply
  (4.5-18V, 25W Input)
- Non-Volitile Flash
- uController
  (Particle Mesh)
- PCB Supports
- Switching Power Regulator
- Snap-off Breakout PCB
  for VL53L0X Chip
- Power Entry
- Neopixel Array
- Touch Controller Interface
  (Multiplexed I2C Comms)
- Day-of-Week Indicator
  (7 Pixels)
- Month/Day/User/Task/Mode Indicators
  (48 Pixels)
- Days 9-16
- Days 25-31
- Months Jan-Aug | Months Sept-Dec
- Users 1-4

## Power pins joined to a net without a drawn wire
LI+: U7.28(LI+)

## Library data of the parts
BO_C1 BO_C2 C1-C18 C28 C29 = resistor:C-US: CAPACITOR, American symbol
BO_JP1 BO_JP2 = MonthCalendar:PINHEAD_1X3: Pin Header - 1 Row, 3 Position
BO_U1 = MonthCalendar:VL53L0X: The VL53L0X is a new generation Time-of-Flight (ToF) laser-ranging module housed in the smallest package on the market today, providing accurate distance measurement whatever the target reflectances unlike conventional technologies. It can measure absolute distances up to 2m, setting a new benchmark in ranging performance levels, opening the door to various new applications. The VL53L0X integrates a leading-edge SPAD array (Single Photon Avalanche Diodes) and embeds ST’s second generation FlightSenseTM patented technology. The VL53L0X’s 940 nm VCSEL emitter (Vertical Cavity Surface-Emitting Laser), is totally invisible to the human eye, coupled with internal physical infrared filters, it enables longer ranging distances, higher immunity to ambient light, and better robustness to cover glass optical crosstalk.
C19-C25 = Particle:TANT-CAP: Tantalum SMT
C26 C27 C30-C34 = resistor_mod:C-US: CAPACITOR, American symbol
D1 = MonthCalendar:DIODE: Diode
JP1-JP6 = MonthCalendar:CON_10POS_1ROW: Connector - 10 Position, 1 Row
JP7-JP10 = MonthCalendar:CON_6POS_1ROW: Connector - 6 Position, 1 Row
L1 = resistor_mod:L-US: INDUCTOR, American symbol
LED1-LED55 = adafruit:WS2812B
MUX1-MUX3 = MonthCalendar:TCA9543A: TCA9543A Low Voltage 2-Channel I2C Bus Switch With Interrupt Logic And Reset
P1 = adafruit:2.1MMJACK: 2.1mm x 5.5mm THM DC jack with internal switch. Digikey part #PJ-102A, 4UCON part #05537 2.1mm x 5.5mm SMT DC jack with internal switch. Digikey part #PJ-002A-SMT, 4UCON part #03267 By microbuilder.eu & adafruit.com
R1-R79 = resistor:R-US_: RESISTOR, American symbol
R80-R83 = resistor_mod:R-US_: RESISTOR, American symbol
TP1 = testpad:TP: Test pad
U1-U6 = MonthCalendar:CAP1208: Microchip - 8-Channel Capacitive Touch Sensor Controller - The CAP1208 is a multiple channel capacitive touch sensor controller. It contains eight (8) individual capacitive touch sensor inputs with programmable sensitivity for use in touch sensor applications. Each sensor input is calibrated to compensate for system parasitic capacitance and automatically recalibrated to compensate for gradual environmental changes. The CAP1208 includes Multiple Pattern Touch recognition that allows the user to select a specific set of buttons to be touched simultaneously. If this pattern is detected, a status bit is set and an interrupt is generated. The CAP1208 has Active and Standby states, each with its own sensor input configuration controls. Power consumption in the Standby state is dependent on the number of sensor inputs enabled as well as averaging, sampling time, and cycle time. Deep Sleep is the lowest power state available, drawing 5μA (typical) of current. In this state, no sensor inputs are active, and communications will wake the device.
U7 = Particle-Devices:ARGON: ARGON The Particle Argon is a powerful Wi-Fi development kit that you can use as a standalone Wi-Fi device or Wi-Fi enabled gateway, repeater, or endpoint for Particle Mesh networks. More information: https://docs.particle.io/argon/ Footprint and formfactor based on Adafruit Feather. <https://www.adafruit.com/feather>
U8 = MonthCalendar:W25Q32: Winbond - W25Q32 Non-Volitile SPI NOR Flash
U9 = MonthCalendar:RT6255A/B_J6F: Richtek - RT6255A/B_J6F Step-Down Converter - 5A, 4.5-18V Input, 500kHz Switching Frequency